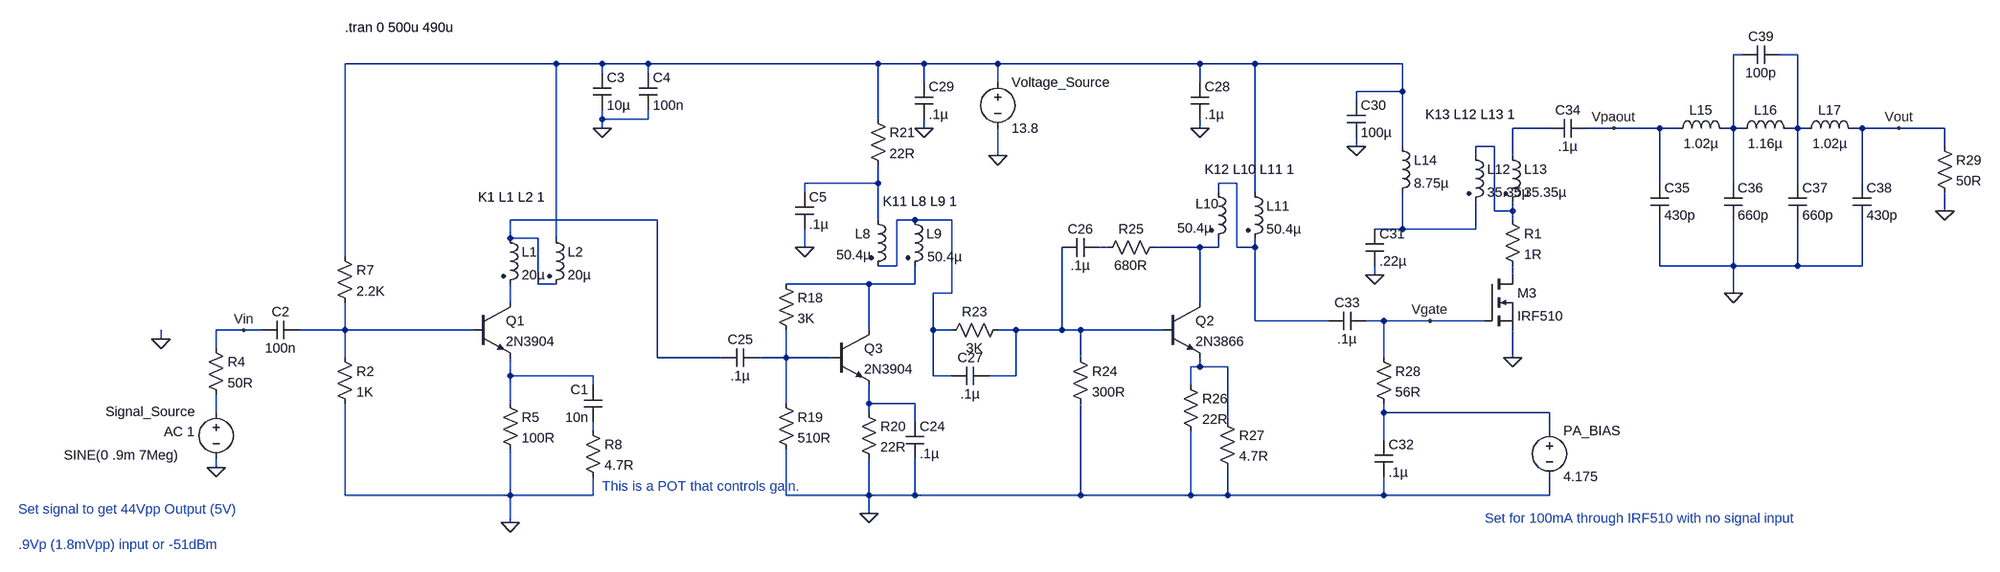
[diagram p0: schematic Power Amp (Orig) Preamp.asc]
Power Amp (Orig) Preamp.asc, the LTspice schematic file:
Version 4
SHEET 1 2548 2304
WIRE 1280 1376 1264 1376
WIRE 1376 1376 1344 1376
WIRE -784 1392 -1152 1392
WIRE -704 1392 -784 1392
WIRE -624 1392 -704 1392
WIRE -224 1392 -624 1392
WIRE -144 1392 -224 1392
WIRE -16 1392 -144 1392
WIRE 336 1392 -16 1392
WIRE 432 1392 336 1392
WIRE 688 1392 432 1392
WIRE -704 1408 -704 1392
WIRE -624 1408 -624 1392
WIRE -144 1424 -144 1392
WIRE -16 1424 -16 1392
WIRE 336 1424 336 1392
WIRE 688 1440 688 1392
WIRE 688 1440 608 1440
WIRE 608 1456 608 1440
WIRE -704 1488 -704 1472
WIRE -624 1488 -624 1472
WIRE -624 1488 -704 1488
WIRE -224 1488 -224 1392
WIRE -704 1504 -704 1488
WIRE -144 1504 -144 1488
WIRE 336 1504 336 1488
WIRE 944 1504 880 1504
WIRE 1056 1504 1008 1504
WIRE 1136 1504 1056 1504
WIRE 1168 1504 1136 1504
WIRE 1264 1504 1264 1376
WIRE 1264 1504 1248 1504
WIRE 1280 1504 1264 1504
WIRE 1376 1504 1376 1376
WIRE 1376 1504 1360 1504
WIRE 1392 1504 1376 1504
WIRE 1488 1504 1472 1504
WIRE 1552 1504 1488 1504
WIRE 1632 1504 1552 1504
WIRE 608 1536 608 1520
WIRE 688 1536 688 1440
WIRE 848 1536 816 1536
WIRE 1632 1536 1632 1504
WIRE -16 1552 -16 1504
WIRE 816 1552 816 1536
WIRE 880 1552 880 1504
WIRE -224 1600 -224 1568
WIRE -224 1600 -352 1600
WIRE 400 1600 368 1600
WIRE 1136 1600 1136 1504
WIRE 1264 1600 1264 1504
WIRE 1376 1600 1376 1504
WIRE 1488 1600 1488 1504
WIRE -352 1616 -352 1600
WIRE 368 1616 368 1600
WIRE 432 1616 432 1392
WIRE 848 1648 848 1536
WIRE 880 1648 880 1632
WIRE 880 1648 848 1648
WIRE 1632 1648 1632 1616
WIRE -608 1664 -864 1664
WIRE -224 1664 -224 1600
WIRE -160 1664 -192 1664
WIRE -96 1664 -160 1664
WIRE 880 1664 880 1648
WIRE 688 1680 688 1616
WIRE 688 1680 640 1680
WIRE 816 1680 816 1632
WIRE 816 1680 688 1680
WIRE -864 1696 -864 1664
WIRE -816 1696 -864 1696
WIRE -784 1696 -784 1392
WIRE -352 1712 -352 1680
WIRE 176 1712 160 1712
WIRE 336 1712 256 1712
WIRE 368 1712 368 1696
WIRE 368 1712 336 1712
WIRE 400 1712 400 1600
WIRE 432 1712 432 1696
WIRE 432 1712 400 1712
WIRE -1152 1728 -1152 1392
WIRE -192 1744 -192 1664
WIRE -192 1744 -224 1744
WIRE 1136 1744 1136 1664
WIRE 1264 1744 1264 1664
WIRE 1264 1744 1136 1744
WIRE 1376 1744 1376 1664
WIRE 1376 1744 1264 1744
WIRE 1488 1744 1488 1664
WIRE 1488 1744 1376 1744
WIRE 640 1760 640 1744
WIRE 880 1760 880 1744
WIRE -816 1776 -816 1696
WIRE -784 1776 -816 1776
WIRE -240 1776 -384 1776
WIRE -160 1776 -160 1744
WIRE -160 1776 -240 1776
WIRE -96 1792 -96 1664
WIRE -96 1792 -128 1792
WIRE 1264 1792 1264 1744
WIRE -864 1808 -864 1776
WIRE 336 1808 336 1712
WIRE 432 1840 432 1712
WIRE 560 1840 432 1840
WIRE 656 1840 624 1840
WIRE 736 1840 656 1840
WIRE 832 1840 736 1840
WIRE -1328 1856 -1376 1856
WIRE -1296 1856 -1328 1856
WIRE -1152 1856 -1152 1808
WIRE -1152 1856 -1232 1856
WIRE -928 1856 -1152 1856
WIRE -240 1856 -240 1776
WIRE -128 1856 -128 1792
WIRE -96 1856 -128 1856
WIRE 16 1856 -16 1856
WIRE 96 1856 96 1712
WIRE 96 1856 16 1856
WIRE 128 1856 96 1856
WIRE 272 1856 128 1856
WIRE -1472 1872 -1472 1856
WIRE -1376 1888 -1376 1856
WIRE -1152 1904 -1152 1856
WIRE -608 1904 -608 1664
WIRE -496 1904 -608 1904
WIRE -384 1904 -384 1856
WIRE -384 1904 -432 1904
WIRE -304 1904 -384 1904
WIRE 128 1904 128 1856
WIRE 656 1904 656 1840
WIRE 880 1904 880 1856
WIRE 336 1920 336 1904
WIRE 336 1920 320 1920
WIRE 384 1920 336 1920
WIRE -864 1936 -864 1904
WIRE -720 1936 -864 1936
WIRE -128 1936 -128 1856
WIRE -96 1936 -128 1936
WIRE 16 1936 16 1856
WIRE 16 1936 -32 1936
WIRE -720 1952 -720 1936
WIRE 320 1952 320 1920
WIRE -864 1984 -864 1936
WIRE -384 1984 -384 1904
WIRE -240 1984 -240 1952
WIRE -160 1984 -240 1984
WIRE -1376 2000 -1376 1968
WIRE -240 2000 -240 1984
WIRE 656 2000 656 1984
WIRE 944 2000 656 2000
WIRE -160 2016 -160 1984
WIRE 384 2016 384 1920
WIRE -720 2032 -720 2016
WIRE 944 2032 944 2000
WIRE 656 2048 656 2000
WIRE -1376 2096 -1376 2080
WIRE -1152 2144 -1152 1984
WIRE -864 2144 -864 2064
WIRE -864 2144 -1152 2144
WIRE -720 2144 -720 2112
WIRE -720 2144 -864 2144
WIRE -384 2144 -384 2064
WIRE -240 2144 -240 2080
WIRE -240 2144 -384 2144
WIRE -160 2144 -160 2080
WIRE -160 2144 -240 2144
WIRE 128 2144 128 1984
WIRE 128 2144 -160 2144
WIRE 320 2144 320 2032
WIRE 320 2144 128 2144
WIRE 384 2144 384 2096
WIRE 384 2144 320 2144
WIRE 656 2144 656 2112
WIRE 656 2144 384 2144
WIRE 944 2144 944 2112
WIRE 944 2144 656 2144
WIRE -240 2176 -240 2144
WIRE -864 2192 -864 2144
FLAG -1376 2096 0
FLAG -240 2176 0
FLAG -352 1712 0
FLAG -16 1552 0
FLAG 336 1504 0
FLAG -144 1504 0
FLAG 608 1536 0
FLAG 640 1760 0
FLAG 1632 1648 0
FLAG 880 1904 0
FLAG 1056 1504 Vpaout
FLAG -1328 1856 Vin
FLAG 736 1840 Vgate
FLAG 1264 1792 0
FLAG 1552 1504 Vout
FLAG -1472 1872 0
FLAG -864 2192 0
FLAG -704 1504 0
SYMBOL voltage -1376 1984 R0
WINDOW 3 -265 90 Left 2
WINDOW 123 -91 49 Left 2
WINDOW 0 -192 14 Left 2
WINDOW 39 0 0 Left 2
SYMATTR Value SINE(0 .9m 7Meg)
SYMATTR Value2 AC 1
SYMATTR InstName Signal_Source
SYMBOL res -1392 1872 R0
SYMATTR InstName R4
SYMATTR Value 50R
SYMBOL npn 272 1808 R0
SYMATTR InstName Q2
SYMATTR Value 2N3866
SYMBOL npn -304 1856 R0
SYMATTR InstName Q3
SYMATTR Value 2N3904
SYMBOL nmos 832 1760 R0
SYMATTR InstName M3
SYMATTR Value IRF510
SYMBOL res -400 1760 R0
SYMATTR InstName R18
SYMATTR Value 3K
SYMBOL res -400 1968 R0
SYMATTR InstName R19
SYMATTR Value 510R
SYMBOL res -256 1984 R0
SYMATTR InstName R20
SYMATTR Value 22R
SYMBOL res -240 1472 R0
SYMATTR InstName R21
SYMATTR Value 22R
SYMBOL ind2 -240 1648 R0
WINDOW 0 -24 40 Left 2
WINDOW 3 -57 77 Left 2
SYMATTR InstName L8
SYMATTR Value 50.4µ
SYMATTR Type ind
SYMBOL ind2 -176 1648 R0
WINDOW 3 38 80 Left 2
SYMATTR Value 50.4µ
SYMATTR InstName L9
SYMATTR Type ind
SYMBOL cap -368 1616 R0
SYMATTR InstName C5
SYMATTR Value .1µ
SYMBOL cap -176 2016 R0
SYMATTR InstName C24
SYMATTR Value .1µ
SYMBOL cap -432 1888 R90
WINDOW 0 0 32 VBottom 2
WINDOW 3 32 32 VTop 2
SYMATTR InstName C25
SYMATTR Value .1µ
SYMBOL voltage -16 1408 R0
WINDOW 123 0 0 Left 2
WINDOW 39 0 0 Left 2
SYMATTR InstName Voltage_Source
SYMATTR Value 13.8
SYMBOL res 0 1840 R90
WINDOW 0 0 56 VBottom 2
WINDOW 3 32 56 VTop 2
SYMATTR InstName R23
SYMATTR Value 3K
SYMBOL res 112 1888 R0
SYMATTR InstName R24
SYMATTR Value 300R
SYMBOL res 272 1696 R90
WINDOW 0 0 56 VBottom 2
WINDOW 3 32 56 VTop 2
SYMATTR InstName R25
SYMATTR Value 680R
SYMBOL cap 160 1696 R90
WINDOW 0 0 32 VBottom 2
WINDOW 3 32 32 VTop 2
SYMATTR InstName C26
SYMATTR Value .1µ
SYMBOL cap -96 1952 R270
WINDOW 0 32 32 VTop 2
WINDOW 3 0 32 VBottom 2
SYMATTR InstName C27
SYMATTR Value .1µ
SYMBOL ind2 352 1600 R0
WINDOW 0 -24 36 Left 2
WINDOW 3 -55 78 Left 2
SYMATTR InstName L10
SYMATTR Value 50.4µ
SYMATTR Type ind
SYMBOL ind2 416 1600 R0
SYMATTR InstName L11
SYMATTR Value 50.4µ
SYMATTR Type ind
SYMBOL res 304 1936 R0
SYMATTR InstName R26
SYMATTR Value 22R
SYMBOL res 368 2000 R0
SYMATTR InstName R27
SYMATTR Value 4.7R
SYMBOL cap 320 1424 R0
SYMATTR InstName C28
SYMATTR Value .1µ
SYMBOL cap -160 1424 R0
SYMATTR InstName C29
SYMATTR Value .1µ
SYMBOL ind2 800 1536 R0
SYMATTR InstName L12
SYMATTR Value 35.35µ
SYMATTR Type ind
SYMBOL ind2 864 1536 R0
SYMATTR InstName L13
SYMATTR Value 35.35µ
SYMATTR Type ind
SYMBOL ind 672 1520 R0
SYMATTR InstName L14
SYMATTR Value 8.75µ
SYMBOL cap 592 1456 R0
SYMATTR InstName C30
SYMATTR Value 100µ
SYMBOL cap 624 1680 R0
SYMATTR InstName C31
SYMATTR Value .22µ
SYMBOL res 640 1888 R0
SYMATTR InstName R28
SYMATTR Value 56R
SYMBOL cap 640 2048 R0
SYMATTR InstName C32
SYMATTR Value .1µ
SYMBOL voltage 944 2016 R0
WINDOW 123 0 0 Left 2
WINDOW 39 0 0 Left 2
SYMATTR InstName PA_BIAS
SYMATTR Value 4.175
SYMBOL cap 624 1824 R90
WINDOW 0 0 32 VBottom 2
WINDOW 3 32 32 VTop 2
SYMATTR InstName C33
SYMATTR Value .1µ
SYMBOL cap 1008 1488 R90
WINDOW 0 0 32 VBottom 2
WINDOW 3 32 32 VTop 2
SYMATTR InstName C34
SYMATTR Value .1µ
SYMBOL res 1616 1520 R0
SYMATTR InstName R29
SYMATTR Value 50R
SYMBOL ind 1152 1520 R270
WINDOW 0 32 56 VTop 2
WINDOW 3 5 56 VBottom 2
SYMATTR InstName L15
SYMATTR Value 1.02µ
SYMBOL ind 1264 1520 R270
WINDOW 0 32 56 VTop 2
WINDOW 3 5 56 VBottom 2
SYMATTR InstName L16
SYMATTR Value 1.16µ
SYMBOL ind 1376 1520 R270
WINDOW 0 32 56 VTop 2
WINDOW 3 5 56 VBottom 2
SYMATTR InstName L17
SYMATTR Value 1.02µ
SYMBOL cap 1120 1600 R0
SYMATTR InstName C35
SYMATTR Value 430p
SYMBOL cap 1248 1600 R0
SYMATTR InstName C36
SYMATTR Value 660p
SYMBOL cap 1360 1600 R0
SYMATTR InstName C37
SYMATTR Value 660p
SYMBOL cap 1472 1600 R0
SYMATTR InstName C38
SYMATTR Value 430p
SYMBOL cap 1344 1360 R90
WINDOW 0 0 32 VBottom 2
WINDOW 3 32 32 VTop 2
SYMATTR InstName C39
SYMATTR Value 100p
SYMBOL res 864 1648 R0
SYMATTR InstName R1
SYMATTR Value 1R
SYMBOL npn -928 1808 R0
SYMATTR InstName Q1
SYMATTR Value 2N3904
SYMBOL res -1168 1888 R0
SYMATTR InstName R2
SYMATTR Value 1K
SYMBOL cap -704 2016 R180
WINDOW 0 24 56 Left 2
WINDOW 3 24 8 Left 2
SYMATTR InstName C1
SYMATTR Value 10n
SYMBOL cap -1232 1840 R90
WINDOW 0 0 32 VBottom 2
WINDOW 3 32 32 VTop 2
SYMATTR InstName C2
SYMATTR Value 100n
SYMBOL ind2 -880 1680 R0
SYMATTR InstName L1
SYMATTR Value 20µ
SYMATTR Type ind
SYMBOL ind2 -800 1680 R0
SYMATTR InstName L2
SYMATTR Value 20µ
SYMATTR Type ind
SYMBOL res -880 1968 R0
SYMATTR InstName R5
SYMATTR Value 100R
SYMBOL cap -720 1408 R0
SYMATTR InstName C3
SYMATTR Value 10µ
SYMBOL res -1168 1712 R0
SYMATTR InstName R7
SYMATTR Value 2.2K
SYMBOL cap -640 1408 R0
SYMATTR InstName C4
SYMATTR Value 100n
SYMBOL res -736 2016 R0
SYMATTR InstName R8
SYMATTR Value 4.7R
TEXT -216 1632 Left 2 !K11 L8 L9 1
TEXT 344 1576 Left 2 !K12 L10 L11 1
TEXT 728 1480 Left 2 !K13 L12 L13 1
TEXT -1720 2168 Left 2 ;Set signal to get 44Vpp Output (5V)\n \n.9Vp (1.8mVpp) input or -51dBm
TEXT 832 2184 Left 2 ;Set for 100mA through IRF510 with no signal input
TEXT -920 1624 Left 2 !K1 L1 L2 1
TEXT -704 2128 Left 2 ;This is a POT that controls gain.
TEXT -1152 1328 Left 2 !.tran 0 500u 490u

The netlist it stands for:
* Power Amp (Orig) Preamp.asc
V§Signal_Source N022 0 SINE(0 .9m 7Meg) AC 1
R4 Vin N022 50R
Q2 N012 N017 N019 0 2N3866
Q3 N014 N018 N021 0 2N3904
M3 N013 Vgate 0 0 IRF510
R18 N014 N018 3K
R19 N018 0 510R
R20 N021 0 22R
R21 N003 N006 22R
L8 N006 N009 50.4µ
L9 N009 N014 50.4µ
C5 N006 0 .1µ
C24 N021 0 .1µ
C25 N018 N008 .1µ
Voltage_Source N003 0 13.8
R23 N017 N009 3K
R24 N017 0 300R
R25 N012 N011 680R
C26 N011 N017 .1µ
C27 N009 N017 .1µ
L10 N007 N012 50.4µ
L11 N003 N007 50.4µ
R26 N019 0 22R
R27 N019 0 4.7R
C28 N003 0 .1µ
C29 N003 0 .1µ
L12 N005 N010 35.35µ
L13 N004 N005 35.35µ
L14 N003 N010 8.75µ
C30 N003 0 100µ
C31 N010 0 .22µ
R28 Vgate N023 56R
C32 N023 0 .1µ
V§PA_BIAS N023 0 4.175
C33 Vgate N007 .1µ
C34 Vpaout N004 .1µ
R29 Vout 0 50R
L15 Vpaout N001 1.02µ
L16 N001 N002 1.16µ
L17 N002 Vout 1.02µ
C35 Vpaout 0 430p
C36 N001 0 660p
C37 N002 0 660p
C38 Vout 0 430p
C39 N002 N001 100p
R1 N005 N013 1R
Q1 N015 N016 N020 0 2N3904
R2 N016 0 1K
C1 N024 N020 10n
C2 N016 Vin 100n
L1 N008 N015 20µ
L2 N003 N008 20µ
R5 N020 0 100R
C3 N003 0 10µ
R7 N003 N016 2.2K
C4 N003 0 100n
R8 N024 0 4.7R
.model NPN NPN
.model PNP PNP
.lib standard.bjt
.model NMOS NMOS
.model PMOS PMOS
.lib standard.mos
K11 L8 L9 1
K12 L10 L11 1
K13 L12 L13 1
* Set signal to get 44Vpp Output (5V)
* .9Vp (1.8mVpp) input or -51dBm
* Set for 100mA through IRF510 with no signal input
K1 L1 L2 1
* This is a POT that controls gain.
.tran 0 500u 490u
.backanno
.end